# EAGLE schematic mini-v1.15-070 (EAGLE 7.2.0)

## Sheet 1 of 4: Main Microcontroller
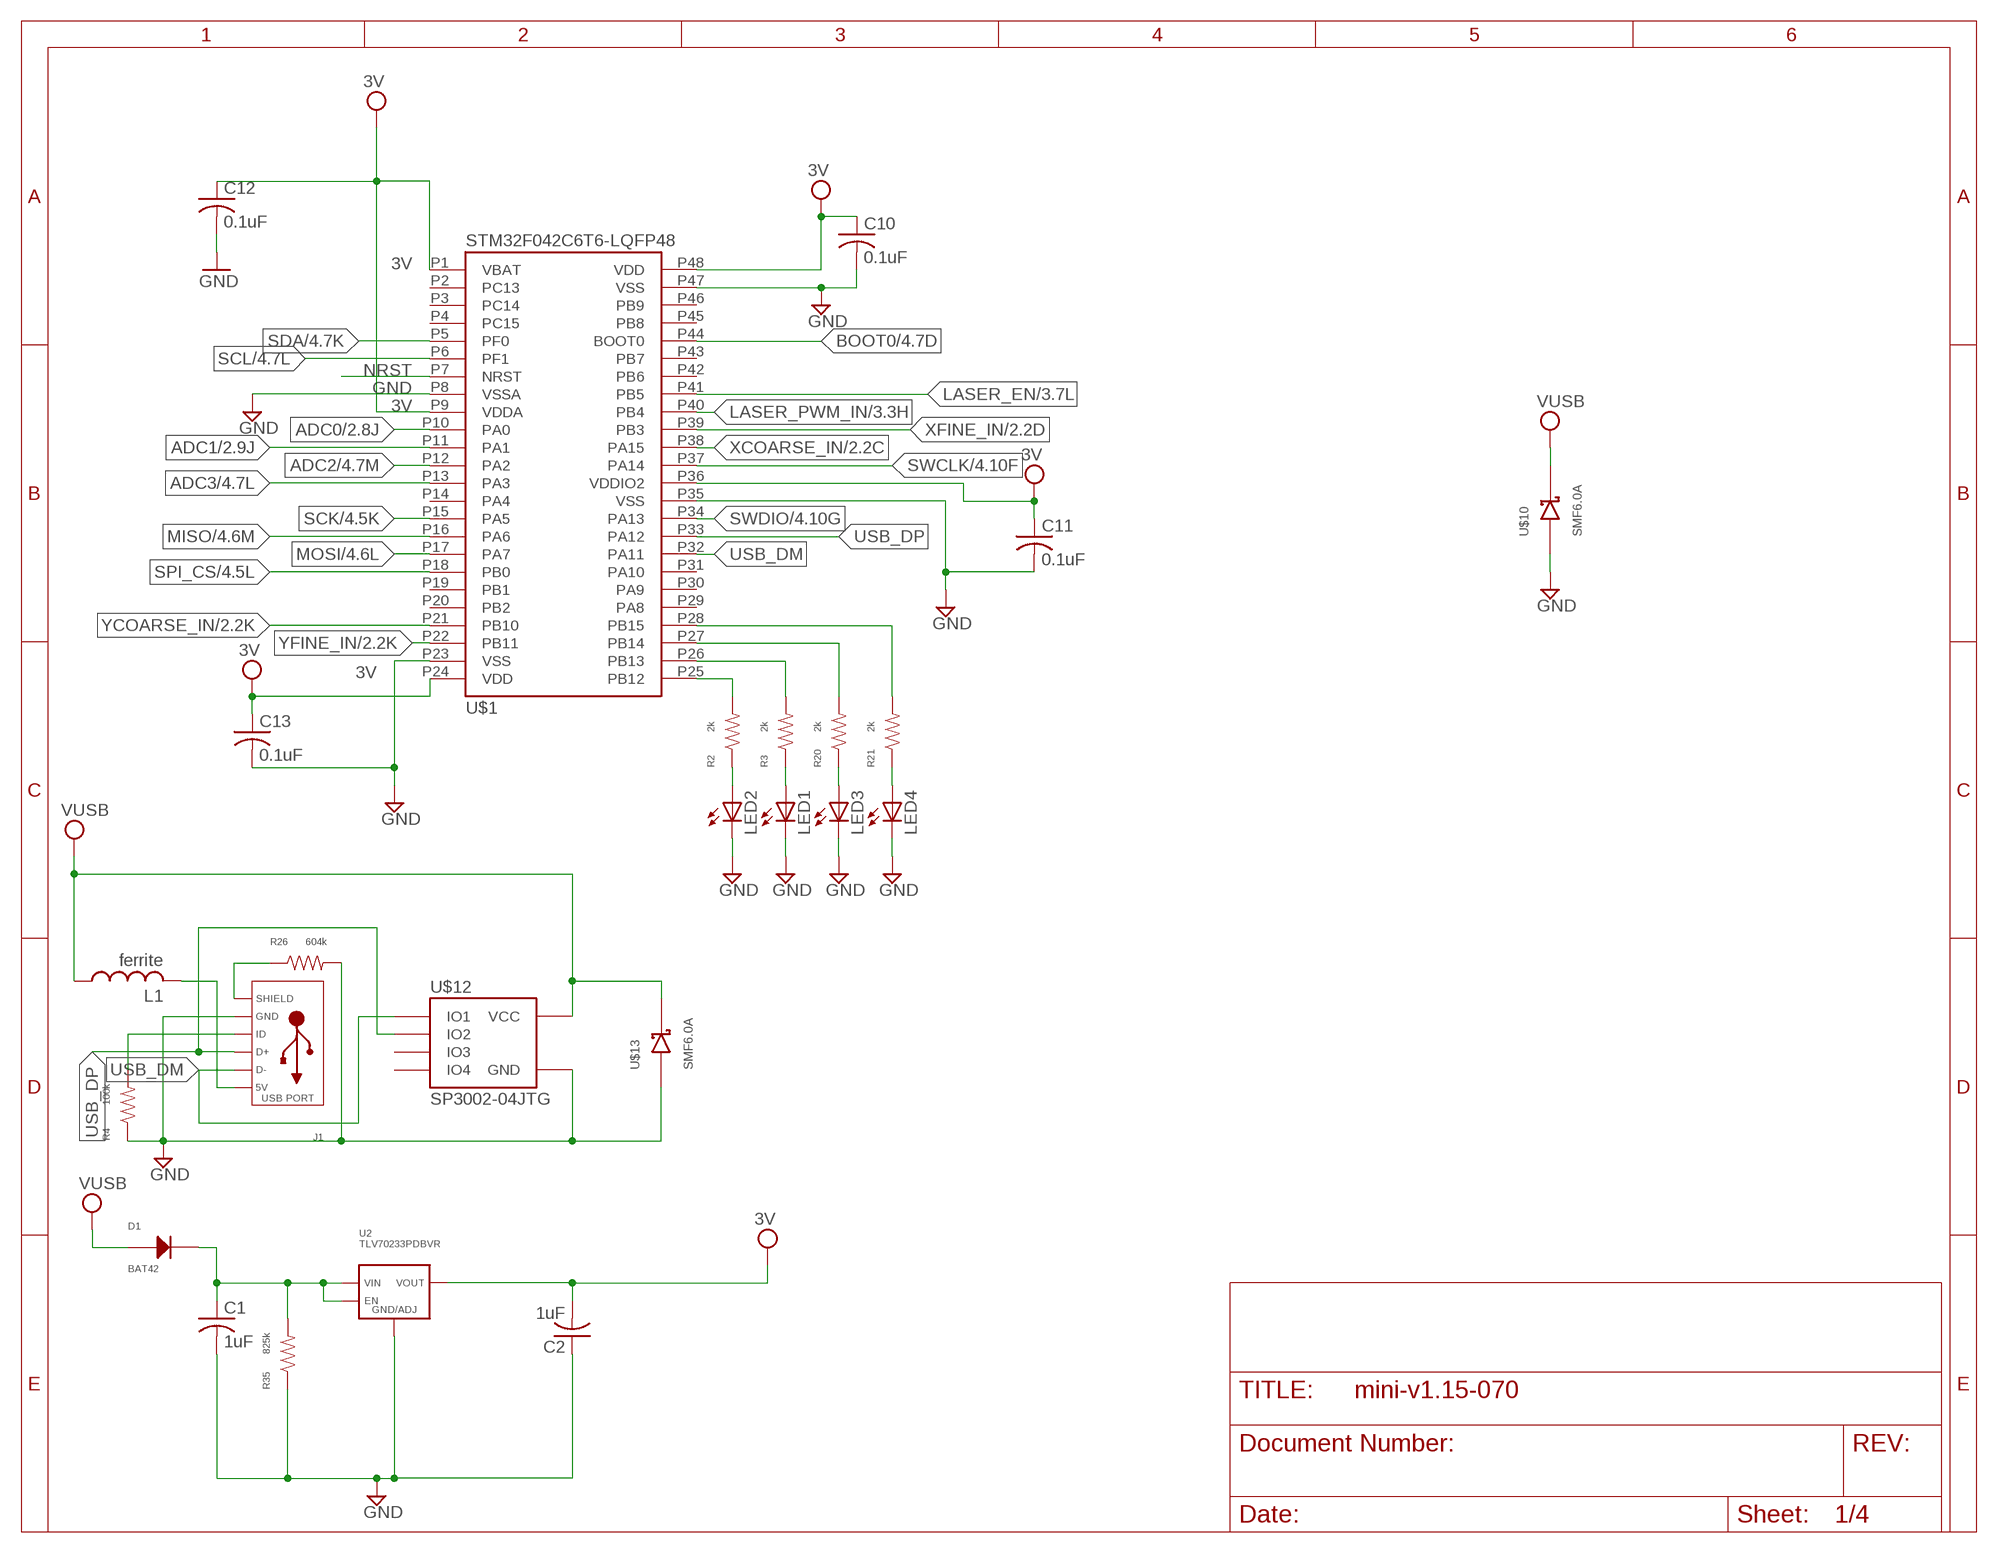
[diagram p0: schematic, sheet 1]

### Parts
C1  1uF  C-USC0603  [C0603]
C2  1uF  C-USC0603  [C0603]
C10  0.1uF  C-USC0603  [C0603]
C11  0.1uF  C-USC0603  [C0603]
C12  0.1uF  C-USC0603  [C0603]
C13  0.1uF  C-USC0603  [C0603]
D1  BAT42  DIODE_SOD-123  [SOD-123]
J1  USB_MICRO_RIGHT  [MICROUSB-RIGHT]
L1  ferrite  L-US  [C0603]
LED1  LEDCHIP-LED0603  [CHIP-LED0603]
LED2  LEDCHIP-LED0603  [CHIP-LED0603]
LED3  LEDCHIP-LED0603  [CHIP-LED0603]
LED4  LEDCHIP-LED0603  [CHIP-LED0603]
R2  2k  RESISTOR_0603  [R0603]
R3  2k  RESISTOR_0603  [R0603]
R4  100k  RESISTOR_0603  [R0603]
R20  2k  RESISTOR_0603  [R0603]
R21  2k  RESISTOR_0603  [R0603]
R26  604k  RESISTOR_0603  [R0603]
R35  825k  RESISTOR_0603  [R0603]
U2  TLV70233PDBVR  [SOT-23-5]
U$1  STM32F042C6T6-LQFP48  STM32F042-LQFP48  [LQFP48]
U$10  SMF6.0A  MBR0520  [SOD123]
U$12  SP3002-04JTG  SP3002  [SC70-6]
U$13  SMF6.0A  MBR0520  [SOD123]

### Nets
3V: C2.2 C10.1 C11.1 C12.1 C13.1 U2.P$5(VOUT) U$1.P1(VBAT) U$1.P9(VDDA) U$1.P24(VDD) U$1.P36(VDDIO2) U$1.P48(VDD) ; also sheet 2,4
ADC0: U$1.P10(PA0) ; also sheet 2
ADC1: U$1.P11(PA1) ; also sheet 2
ADC2: U$1.P12(PA2) ; also sheet 4
ADC3: U$1.P13(PA3) ; also sheet 4
BOOT0: U$1.P44(BOOT0) ; also sheet 4
GND [Power]: C1.2 C2.1 C10.2 C11.2 C12.2 C13.2 J1.5(GND) LED1.C LED2.C LED3.C LED4.C R4.P$1 R26.P$2 R35.P$1 U2.P$2(GND/ADJ) U$1.P8(VSSA) U$1.P23(VSS) U$1.P35(VSS) U$1.P47(VSS) U$10.ANODE U$12.P2(GND) U$13.ANODE ; also sheet 2,3,4
LASER_EN: U$1.P41(PB5) ; also sheet 3
LASER_PWM_IN: U$1.P40(PB4) ; also sheet 3
MISO: U$1.P16(PA6) ; also sheet 4
MOSI: U$1.P17(PA7) ; also sheet 4
N$2: R2.P$2 U$1.P25(PB12)
N$3: LED2.A R2.P$1
N$4: C1.1 D1.CATHODE R35.P$2 U2.P$1(VIN) U2.P$3(EN)
N$5: J1.4(ID) R4.P$2
N$12: LED1.A R3.P$1
N$13: R3.P$2 U$1.P26(PB13)
N$14: J1.1(5V) L1.2
N$18: J1.S1(SLD) J1.S2(SLD) J1.S3(SLD) J1.S4(SLD) J1.S5(SLD) J1.S6(SLD) R26.P$1
N$24: LED3.A R20.P$1
N$27: LED4.A R21.P$1
N$28: R20.P$2 U$1.P27(PB14)
N$29: R21.P$2 U$1.P28(PB15)
NRST: U$1.P7(NRST) ; also sheet 4
SCK: U$1.P15(PA5) ; also sheet 4
SCL: U$1.P6(PF1) ; also sheet 4
SDA: U$1.P5(PF0) ; also sheet 4
SPI_CS: U$1.P18(PB0) ; also sheet 4
SWCLK: U$1.P37(PA14) ; also sheet 4
SWDIO: U$1.P34(PA13) ; also sheet 4
USB_DM: J1.2(D-) U$1.P32(PA11) U$12.P1(IO1)
USB_DP: J1.3(D+) U$1.P33(PA12) U$12.P3(IO2)
VUSB [Power]: D1.ANODE L1.1 U$10.CATHODE U$12.P5(VCC) U$13.CATHODE ; also sheet 2,3,4
XCOARSE_IN: U$1.P38(PA15) ; also sheet 2
XFINE_IN: U$1.P39(PB3) ; also sheet 2
YCOARSE_IN: U$1.P21(PB10) ; also sheet 2
YFINE_IN: U$1.P22(PB11) ; also sheet 2
Unconnected: U$1.P2(PC13) U$1.P3(PC14) U$1.P4(PC15) U$1.P14(PA4) U$1.P19(PB1) U$1.P20(PB2) U$1.P29(PA8) U$1.P30(PA9) U$1.P31(PA10) U$1.P42(PB6) U$1.P43(PB7) U$1.P45(PB8) U$1.P46(PB9) U$12.P4(IO3) U$12.P6(IO4)

## Sheet 2 of 4: Dual PWM
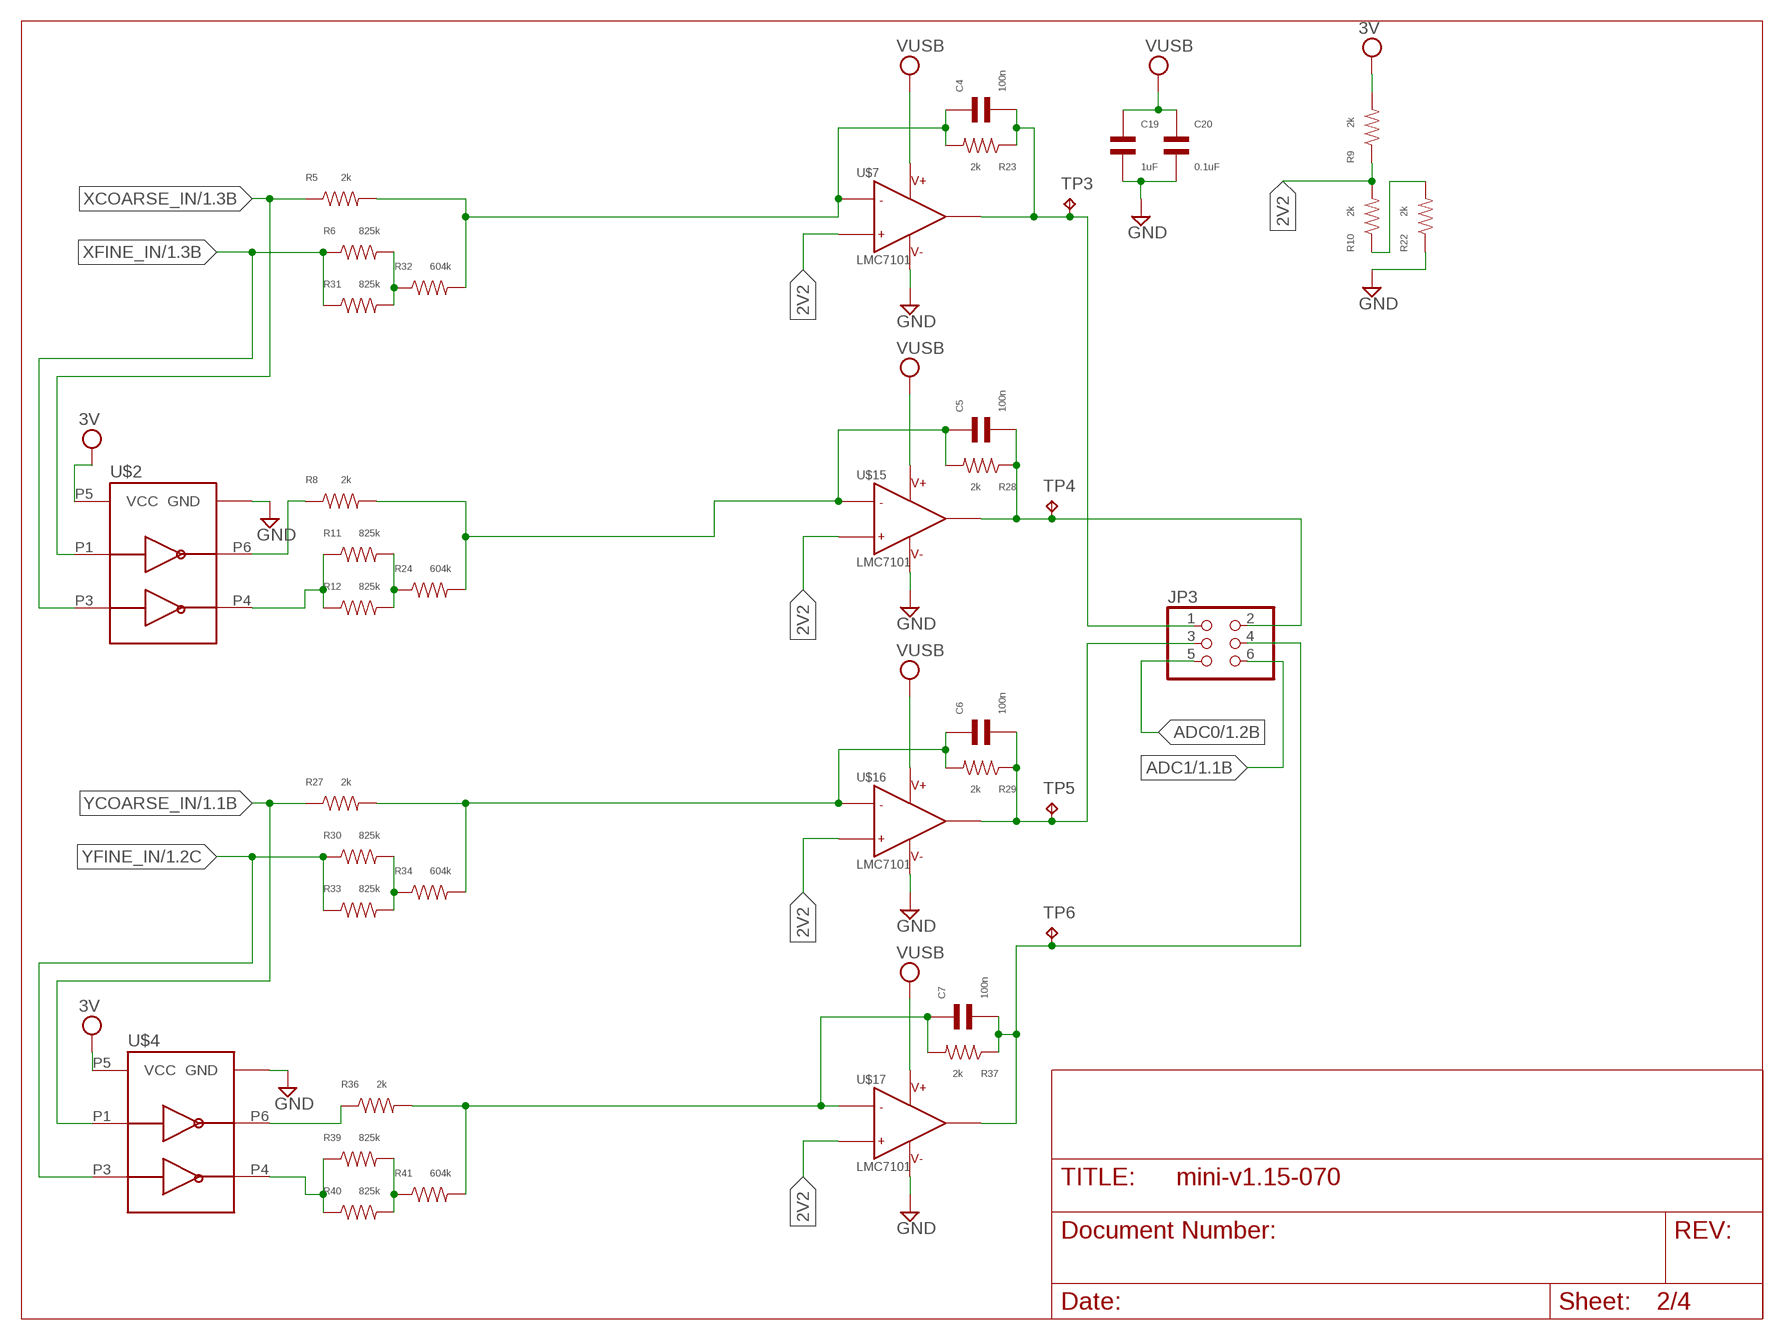
[diagram p1: schematic, sheet 2]

### Parts
C4  100n  CAPACITOR_NP_0603  [C0603]
C5  100n  CAPACITOR_NP_0603  [C0603]
C6  100n  CAPACITOR_NP_0603  [C0603]
C7  100n  CAPACITOR_NP_0603  [C0603]
C19  1uF  CAPACITOR_NP_0603  [C0603]
C20  0.1uF  CAPACITOR_NP_0603  [C0603]
JP3  PINHD-2X3  [2X03]
R5  2k  RESISTOR_0603  [R0603]
R6  825k  RESISTOR_0603  [R0603]
R8  2k  RESISTOR_0603  [R0603]
R9  2k  RESISTOR_0603  [R0603]
R10  2k  RESISTOR_0603  [R0603]
R11  825k  RESISTOR_0603  [R0603]
R12  825k  RESISTOR_0603  [R0603]
R22  2k  RESISTOR_0603  [R0603]
R23  2k  RESISTOR_0603  [R0603]
R24  604k  RESISTOR_0603  [R0603]
R27  2k  RESISTOR_0603  [R0603]
R28  2k  RESISTOR_0603  [R0603]
R29  2k  RESISTOR_0603  [R0603]
R30  825k  RESISTOR_0603  [R0603]
R31  825k  RESISTOR_0603  [R0603]
R32  604k  RESISTOR_0603  [R0603]
R33  825k  RESISTOR_0603  [R0603]
R34  604k  RESISTOR_0603  [R0603]
R36  2k  RESISTOR_0603  [R0603]
R37  2k  RESISTOR_0603  [R0603]
R39  825k  RESISTOR_0603  [R0603]
R40  825k  RESISTOR_0603  [R0603]
R41  604k  RESISTOR_0603  [R0603]
TP3  TPB1,27  [B1,27]
TP4  TPB1,27  [B1,27]
TP5  TPB1,27  [B1,27]
TP6  TPB1,27  [B1,27]
U$2  NC7WZ14P6X  [SC70-6]
U$4  NC7WZ14P6X  [SC70-6]
U$7  LMC7101  [SOT23-5]
U$15  LMC7101  [SOT23-5]
U$16  LMC7101  [SOT23-5]
U$17  LMC7101  [SOT23-5]

### Nets
2V2: R9.P$1 R10.P$2 U$7.3 U$15.3 U$16.3 U$17.3
3V: R9.P$2 U$2.P5(VCC) U$4.P5(VCC) ; also sheet 1,4
ADC0: JP3.5 ; also sheet 1
ADC1: JP3.6 ; also sheet 1
COARSE1: R8.P$1 U$2.P6(Y1)
FINE1: R11.P$1 R12.P$1 U$2.P4(Y2)
FINE3: R39.P$1 R40.P$1 U$4.P4(Y2)
GND [Power]: C19.P$2 C20.P$2 R22.P$1 U$2.P2(GND) U$4.P2(GND) U$7.5 U$15.5 U$16.5 U$17.5 ; also sheet 1,3,4
N$7: R36.P$1 U$4.P6(Y1)
N$8: R11.P$2 R12.P$2 R24.P$1
N$10: C5.P$1 R8.P$2 R24.P$2 R28.P$2 U$15.4
N$22: R10.P$1 R22.P$2
N$30: R30.P$2 R33.P$2 R34.P$1
N$31: R6.P$2 R31.P$2 R32.P$1
N$32: C6.P$1 R27.P$2 R29.P$2 R34.P$2 U$16.4
N$35: R39.P$2 R40.P$2 R41.P$1
N$36: C7.P$1 R36.P$2 R37.P$2 R41.P$2 U$17.4
OUT: C4.P$2 JP3.1 R23.P$1 TP3.TP U$7.1
OUT1: C5.P$2 JP3.2 R28.P$1 TP4.TP U$15.1
OUT2: C6.P$2 JP3.3 R29.P$1 TP5.TP U$16.1
OUT3: C7.P$2 JP3.4 R37.P$1 TP6.TP U$17.1
VUSB [Power]: C19.P$1 C20.P$1 U$7.2 U$15.2 U$16.2 U$17.2 ; also sheet 1,3,4
XCOARSE_IN: R5.P$1 U$2.P1(A1) ; also sheet 1
XFINE_IN: R6.P$1 R31.P$1 U$2.P3(A2) ; also sheet 1
XSUM: C4.P$1 R5.P$2 R23.P$2 R32.P$2 U$7.4
YCOARSE_IN: R27.P$1 U$4.P1(A1) ; also sheet 1
YFINE_IN: R30.P$1 R33.P$1 U$4.P3(A2) ; also sheet 1

## Sheet 3 of 4: Laser Power Driver
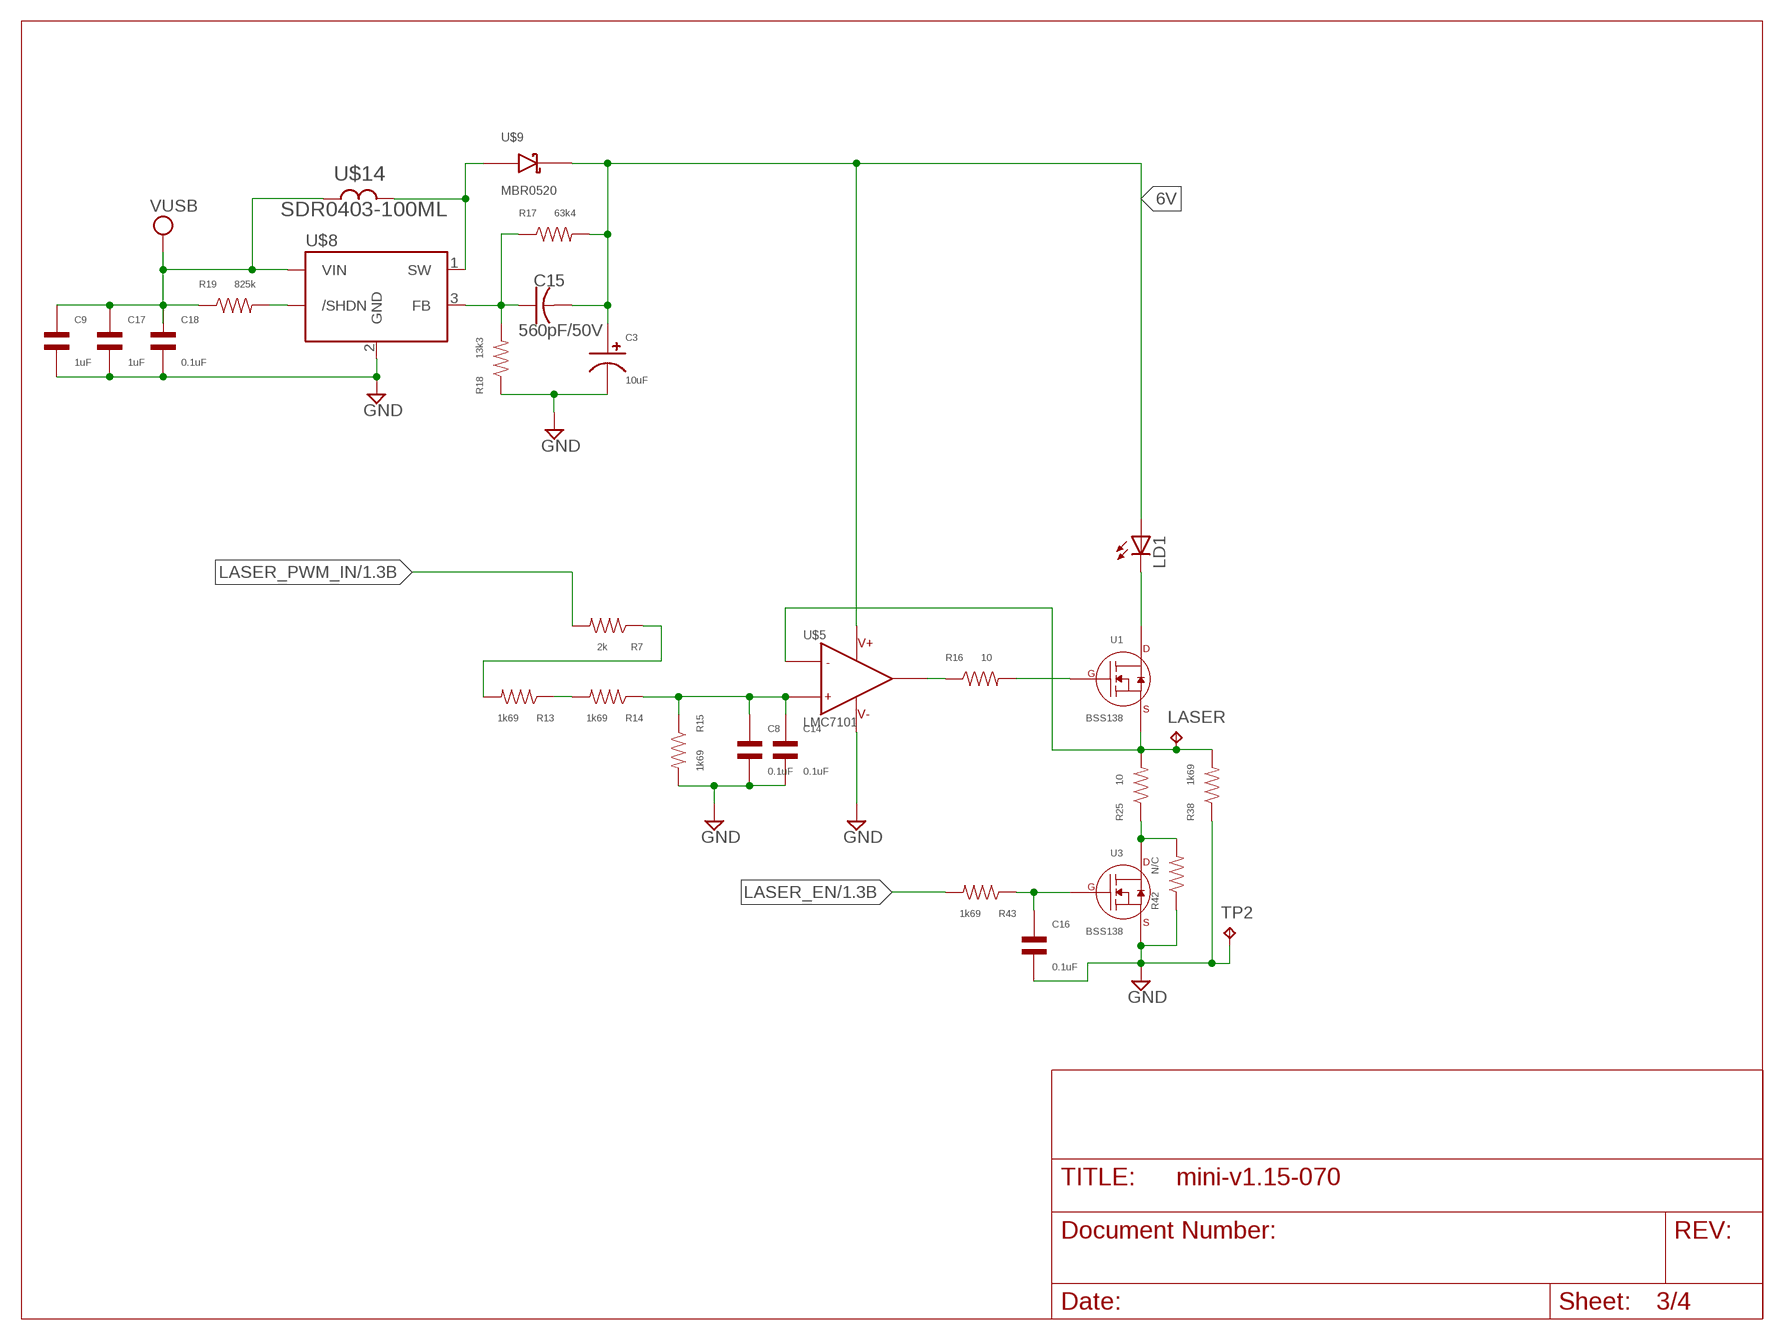
[diagram p2: schematic, sheet 3]

### Parts
C3  10uF  CAPACITOR_P_4MM  [CP4MM]
C8  0.1uF  CAPACITOR_NP_0603  [C0603]
C9  1uF  CAPACITOR_NP_0603  [C0603]
C14  0.1uF  CAPACITOR_NP_0603  [C0603]
C15  560pF/50V  C-USC0603  [C0603]
C16  0.1uF  CAPACITOR_NP_0603  [C0603]
C17  1uF  CAPACITOR_NP_0603  [C0603]
C18  0.1uF  CAPACITOR_NP_0603  [C0603]
LASER  TPB2,54  [B2,54]
LD1  SCOTT_LASERDIODELD3  [SCOTT_LASERDIODE3]
R7  2k  RESISTOR_0603  [R0603]
R13  1k69  RESISTOR_0603  [R0603]
R14  1k69  RESISTOR_0603  [R0603]
R15  1k69  RESISTOR_0603  [R0603]
R16  10  RESISTOR_0603  [R0603]
R17  63k4  RESISTOR_0603  [R0603]
R18  13k3  RESISTOR_0603  [R0603]
R19  825k  RESISTOR_0603  [R0603]
R25  10  RESISTOR_0603  [R0603]
R38  1k69  RESISTOR_0603  [R0603]
R42  N/C  RESISTOR_0603  [R0603]
R43  1k69  RESISTOR_0603  [R0603]
TP2  GND  TPB2,54  [B2,54]
U1  BSS138  N-CHANNEL_FET_SOT-23-3  [SOT-23-3]
U3  BSS138  N-CHANNEL_FET_SOT-23-3  [SOT-23-3]
U$5  LMC7101  OPAMP-SINGLELMC7101  [SOT23-5]
U$8  LMR62014  [SOT23-5]
U$9  MBR0520  [SOD123]
U$14  SDR0403-100ML  SDR0403  [SDR0403]

### Nets
6V [Power]: C3.P$1 C15.2 LD1.P$1(A) R17.P$2 U$5.2(V+) U$9.CATHODE
GND [Power]: C3.P$2 C8.P$2 C9.P$2 C14.P$2 C16.P$2 C17.P$2 C18.P$2 R15.P$2 R18.P$1 R38.P$1 R42.P$1 TP2.TP U3.P$2(SOURCE) U$5.5(V-) U$8.2(GND) ; also sheet 1,2,4
LASER_EN: R43.P$2 ; also sheet 1
LASER_PWM_IN: R7.P$2 ; also sheet 1
N$1: R25.P$1 R42.P$2 U3.P$3(DRAIN)
N$6: R7.P$1 R13.P$2
N$9: R13.P$1 R14.P$2
N$11: C8.P$1 C14.P$1 R14.P$1 R15.P$1 U$5.3(IN+)
N$15: U$8.1(SW) U$9.ANODE U$14.P$2
N$16 [Power]: LD1.P$3(C) U1.P$3(DRAIN)
N$17 [Power]: LASER.TP R25.P$2 R38.P$2 U1.P$2(SOURCE) U$5.4(IN-)
N$19 [Power]: R16.P$2 U1.P$1(GATE)
N$20: R16.P$1 U$5.1(OUT)
N$21: C16.P$1 R43.P$1 U3.P$1(GATE)
N$25: C15.1 R17.P$1 R18.P$2 U$8.3(FB)
N$26: R19.P$2 U$8.4(/SHDN)
VUSB [Power]: C9.P$1 C17.P$1 C18.P$1 R19.P$1 U$8.5(VIN) U$14.P$1 ; also sheet 1,2,4

## Sheet 4 of 4
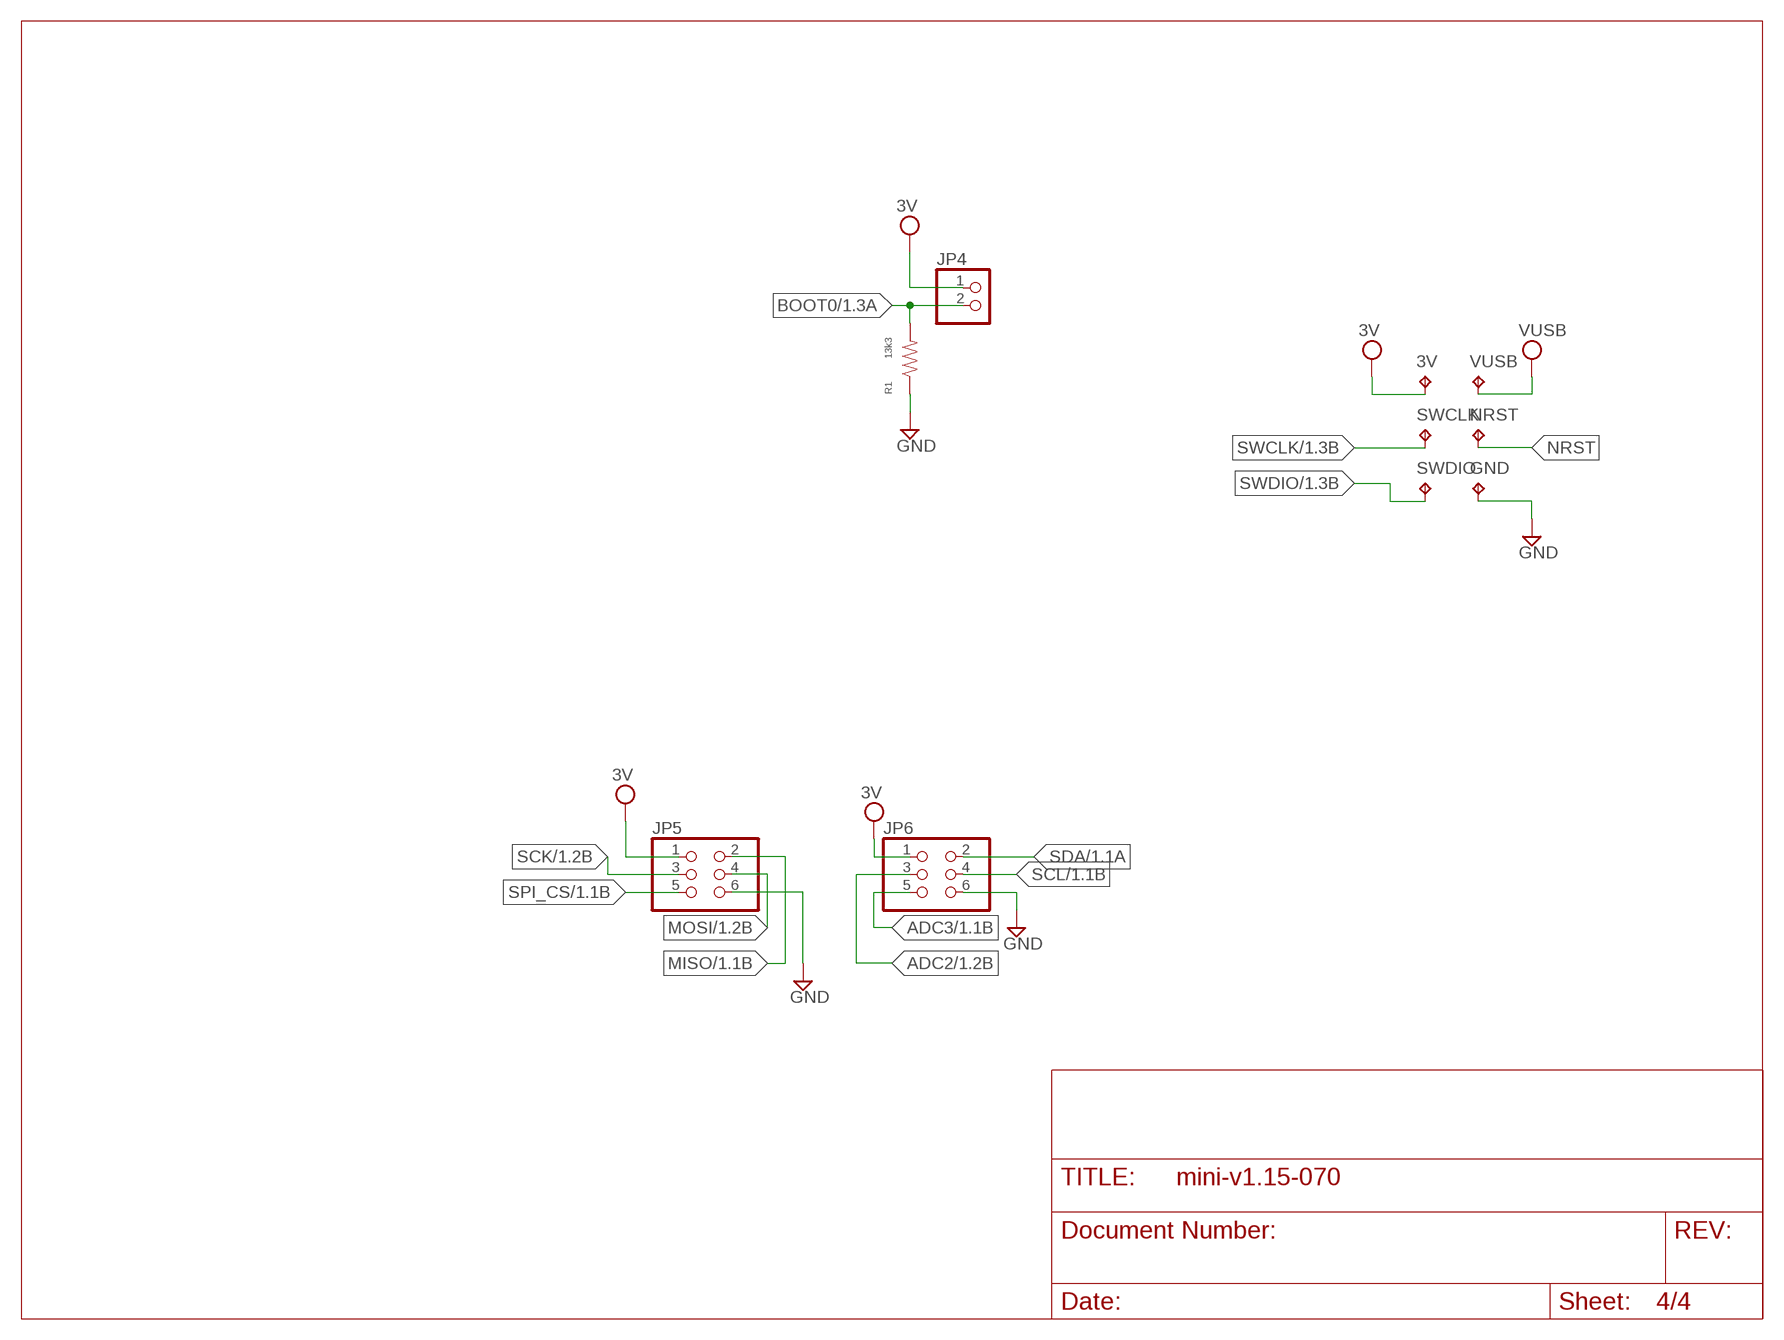
[diagram p3: schematic, sheet 4]

### Parts
3V  TPB1,27  [B1,27]
GND  TPB1,27  [B1,27]
JP4  PINHD-1X2  [1X02]
JP5  PINHD-2X3  [2X03]
JP6  PINHD-2X3  [2X03]
NRST  TPB1,27  [B1,27]
R1  13k3  RESISTOR_0603  [R0603]
SWCLK  TPB1,27  [B1,27]
SWDIO  TPB1,27  [B1,27]
VUSB  TPB1,27  [B1,27]

### Nets
3V: 3V.TP JP4.1 JP5.1 JP6.1 ; also sheet 1,2
ADC2: JP6.3 ; also sheet 1
ADC3: JP6.5 ; also sheet 1
BOOT0: JP4.2 R1.P$2 ; also sheet 1
GND [Power]: GND.TP JP5.6 JP6.6 R1.P$1 ; also sheet 1,2,3
MISO: JP5.2 ; also sheet 1
MOSI: JP5.4 ; also sheet 1
NRST: NRST.TP ; also sheet 1
SCK: JP5.3 ; also sheet 1
SCL: JP6.4 ; also sheet 1
SDA: JP6.2 ; also sheet 1
SPI_CS: JP5.5 ; also sheet 1
SWCLK: SWCLK.TP ; also sheet 1
SWDIO: SWDIO.TP ; also sheet 1
VUSB [Power]: VUSB.TP ; also sheet 1,2,3

## Library data of the parts
3V GND LASER NRST SWCLK SWDIO TP2-TP6 VUSB = testpad:TP: Test pad
C1 C2 C10-C13 C15 = rcl:C-US: CAPACITOR, American symbol
C3 = MF_Passives:CAPACITOR_P: Library: MF_Passives Description: Device for Polarized Capacitors. Manufacture part number (MFG#), Voltage Rating, and Tolerance can be added via Attributes.; MFG#: N/A; TOLERANCE: N/A; VOLTAGE: N/A
C4-C9 C14 C16-C20 = MF_Passives:CAPACITOR_NP: Library: MF_Passives Description: Device for Non-Polarized Capacitors. Manufacture part number (MFG#), Voltage, Temperature Coefficient, and Tolerance can be added via Attributes.; MFG#: N/A; TEMP_COF: N/A; TOLERANCE: N/A; VOLTAGE: N/A
D1 = MF_Discrete_Semiconductor:DIODE: Library: MF_Discrete_Semiconductor Description: Device for Single Packaged Diodes. Manufacture part number (MFG#) can be added via Attributes.; MFG#: N/A
J1 = MF_Connectors:USB: Library: MF_Connectors Description: 5 Pin USB Connectors. SLD is the shield connection. Usually tied to ground through a small ferrite bead.
JP3 JP5 JP6 = pinhead:PINHD-2X3: PIN HEADER
JP4 = pinhead:PINHD-1X2: PIN HEADER
L1 = lmdparts:L-US: INDUCTOR, American symbol
LD1 = mini-v1.14-macrofab-rtg:SCOTT_LASERDIODE; MPN: 3 x (0552-2-15-15-11-27-10-0)
LED1-LED4 = adafruit:LED: LED OSRAM: - CHIPLED LG R971, LG N971, LY N971, LG Q971, LY Q971, LO R971, LY R971 LH N974, LH R974 LS Q976, LO Q976, LY Q976 LO Q996 - Hyper CHIPLED LW Q18S LB Q993, LB Q99A, LB R99A - SideLED LS A670, LO A670, LY A670, LG A670, LP A670 LB A673, LV A673, LT A673, LW A673 LH A674 LY A675 LS A676, LA A676, LO A676, LY A676, LW A676 LS A679, LY A679, LG A679 - Hyper Micro SIDELED® LS Y876, LA Y876, LO Y876, LY Y876 LT Y87S - SmartLED LW L88C, LW L88S LB L89C, LB L89S, LG L890 LS L89K, LO L89K, LY L89K LS L896, LA L896, LO L896, LY L896 - TOPLED LS T670, LO T670, LY T670, LG T670, LP T670 LSG T670, LSP T670, LSY T670, LOP T670, LYG T670 LG T671, LOG T671, LSG T671 LB T673, LV T673, LT T673, LW T673 LH T674 LS T676, LA T676, LO T676, LY T676, LB T676, LH T676, LSB T676, LW T676 LB T67C, LV T67C, LT T67C, LS T67K, LO T67K, LY T67K, LW E67C LS E67B, LA E67B, LO E67B, LY E67B, LB E67C, LV E67C, LT E67C LW T67C LS T679, LY T679, LG T679 LS T770, LO T770, LY T770, LG T770, LP T770 LB T773, LV T773, LT T773, LW T773 LH T774 LS E675, LA E675, LY E675, LS T675 LS T776, LA T776, LO T776, LY T776, LB T776 LHGB T686 LT T68C, LB T68C - Hyper Mini TOPLED® LB M676 - Mini TOPLED Santana® LG M470 LS M47K, LO M47K, LY M47K Source: http://www.osram.convergy.de/
R1-R43 = MF_Passives:RESISTOR: Library: MF_Passives Description: Device for Resistors. Manufacture part number (MFG#), Voltage, Tolerance, and Wattage Rating can be added via Attributes.; MFG#: N/A; TOLERANCE: N/A; VOLTAGE: N/A; WATTAGE: N/A
U1 U3 = MF_Discrete_Semiconductor:N-CHANNEL_FET: Library: MF_Discrete_Semiconductor Description: Device for Single N-Channel Mosfet. Manufacture part number (MFG#) can be added via Attributes.
U2 = MF_IC_Power:TLV702: Manufacturer Part #: TLV702 Manufacturer: Texas Instruments Description: LDO Voltage Regulators
U$1 = lmdparts:STM32F042-LQFP48
U$2 U$4 = lmdparts:NC7WZ14P6X: 2-circuit logic inverter, ultra-high-speed and cheap
U$5 = lmdparts:OPAMP-SINGLE: Single amp opamps
U$7 U$15-U$17 = lmdparts:LMC7101
U$8 = lmdparts:LMR62014
U$9 U$10 U$13 = lmdparts:MBR0520
U$12 = lmdparts:SP3002
U$14 = lmdparts:SDR0403

## Net classes
1 Power: width 0.305 mm